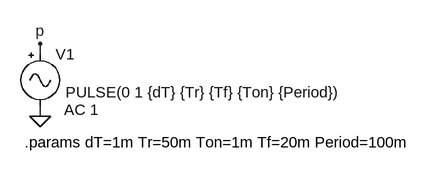
[diagram p0: schematic GenTrap.asc]
GenTrap.asc, the LTspice schematic file:
Version 4
SHEET 1 880 680
WIRE 48 96 48 80
WIRE 48 192 48 176
FLAG 48 192 0
FLAG 48 80 p
SYMBOL Misc\\signal 48 80 R0
WINDOW 123 37 102 Left 0
WINDOW 39 0 0 Left 0
WINDOW 3 39 75 Left 0
SYMATTR Value2 AC 1
SYMATTR InstName V1
SYMATTR Value PULSE(0 1 {dT} {Tr} {Tf} {Ton} {Period})
TEXT 24 232 Left 0 !.params dT=1m Tr=50m Ton=1m Tf=20m Period=100m

The netlist it stands for:
* GenTrap.asc
V1 p 0 PULSE(0 1 {dT} {Tr} {Tf} {Ton} {Period}) AC 1
.params dT=1m Tr=50m Ton=1m Tf=20m Period=100m
.backanno
.end